# Altium project PCB_Project.PrjPcb
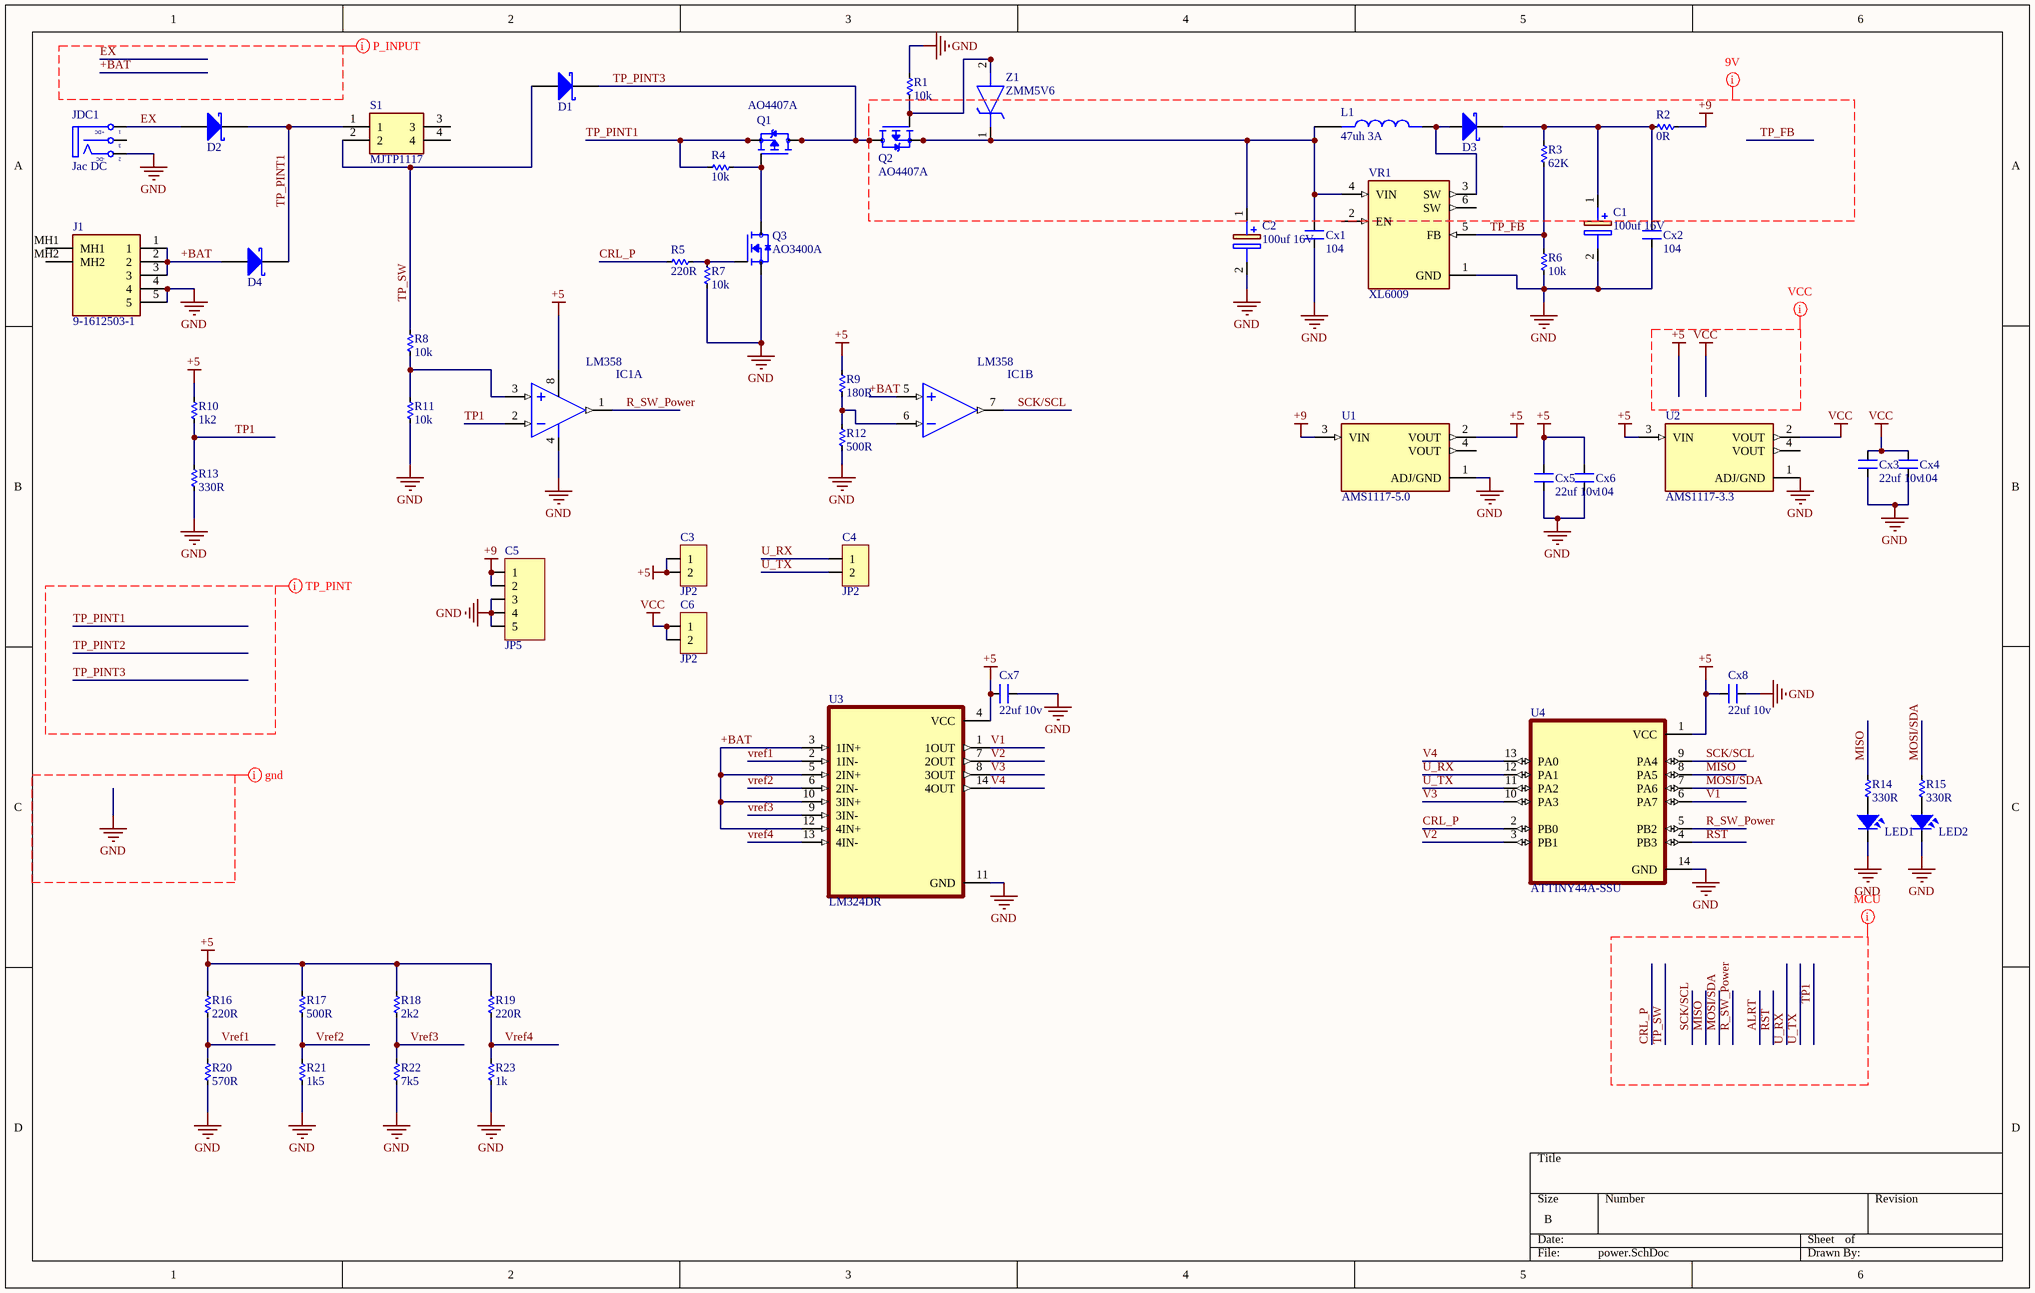
[diagram p0: power.SchDoc]
1 sheet, 57 parts. Net scope: global (net labels, ports and power ports of the same name join across sheets).
Board file: Power.PcbDoc

## Sheet power.SchDoc
size B

### Parts
C1  100uf 16V  [CAPPM7343X310N]
C2  100uf 16V  [CAPPM7343X310N]
C3  JP2  [JP2-C1T]
C4  JP2  [JP2-C1T]
C5  JP5  [JP5-C1T]
C6  JP2  [JP2-C1T]
Cx1  104  [CN-SMD-0805]
Cx2  104  [CN-SMD-0805]
Cx3  22uf 10v  [CN-SMD-1206]
Cx4  104  [CN-SMD-0805]
Cx5  22uf 10v  [CN-SMD-1206]
Cx6  104  [CN-SMD-0805]
Cx7  22uf 10v  [CN-SMD-1206]
Cx8  22uf 10v  [CN-SMD-1206]
D1  D Schottky  [SS34]  (value not drawn)
D2  D Schottky  [SS34]  (value not drawn)
D3  D Schottky  [SS34]  (value not drawn)
D4  D Schottky  [SS34]  (value not drawn)
IC1  LM358  [SO8]  (parts A,B of 2)
J1  9-1612503-1  [916125031]
JDC1  Jac DC  [DC3]
L1  47uh 3A  [IND_#B952AS-H-470M=P3]
LED1  LED  [LED-0805-Red]  (value not drawn)
LED2  LED  [LED-0805-Green]  (value not drawn)
Q1  AO4407A  [SOIC127P600X175-8N]
Q2  AO4407A  [SOIC127P600X175-8N]
Q3  AO3400A  [SOT95P280X125-3N]
R1  10k  [RES-SMD-0603]
R2  0R  [RES-SMD-0603]
R3  62K  [RES-SMD-0603]
R4  10k  [RES-SMD-0603]
R5  220R  [RES-SMD-0603]
R6  10k  [RES-SMD-0603]
R7  10k  [RES-SMD-0603]
R8  10k  [RES-SMD-0603]
R9  180R  [RES-SMD-0603]
R10  1k2  [RES-SMD-0603]
R11  10k  [RES-SMD-0603]
R12  500R  [RES-SMD-0603]
R13  330R  [RES-SMD-0603]
R14  330R  [RES-SMD-0603]
R15  330R  [RES-SMD-0603]
R16  220R  [RES-SMD-0603]
R17  500R  [RES-SMD-0603]
R18  2k2  [RES-SMD-0603]
R19  220R  [RES-SMD-0603]
R20  570R  [RES-SMD-0603]
R21  1k5  [RES-SMD-0603]
R22  7k5  [RES-SMD-0603]
R23  1k  [RES-SMD-0603]
S1  MJTP1117  [MJTP1117]
U1  AMS1117-5.0  [SOT229P700X180-4N]
U2  AMS1117-3.3  [SOT229P700X180-4N]
U3  LM324DR  [SOIC127P600X175-14N]
U4  ATTINY44A-SSU  [SOIC127P600X175-14N]
VR1  XL6009  [DPAK170P1435X465-6N]
Z1  ZMM5V6  [ZMM5V6]

### Nets
+5: C3.1 C3.2 Cx5.2 Cx6.2 Cx7.1 Cx8.2 IC1.8(+V) R9.1 R10.1 R16.1 R17.1 R18.1 R19.1 U1.2(VOUT) U2.3(VIN) U3.4(VCC) U4.1(VCC)
+9: C5.1 C5.2 R2.2 U1.3(VIN)
GND: C1.2(-) C2.2(-) C5.3 C5.4 C5.5 Cx1.1 Cx2.1 Cx3.1 Cx4.1 Cx5.1 Cx6.1 Cx7.2 Cx8.1 IC1.4(-V) J1.4 J1.5 JDC1.2(TN) LED1.2 LED2.2 Q3.2(S) R1.2 R6.2 R7.1 R11.2 R12.2 R13.2 R20.2 R21.2 R22.2 R23.2 U1.1(ADJ/GND) U2.1(ADJ/GND) U3.11(GND) U4.14(GND) VR1.1(GND)
VCC: C6.1 C6.2 Cx3.2 Cx4.2 U2.2(VOUT)
+BAT: D4.1(A) IC1.5(IN+) J1.1 J1.2 J1.3 U3.3(1IN+) U3.5(2IN+) U3.10(3IN+) U3.12(4IN+)
CRL_P: R5.1 U4.2(PB0)
EX: D2.1(A) JDC1.1(T)
MISO: R14.2 U4.8(PA5)
MOSI/SDA: R15.2 U4.7(PA6)
R_SW_Power: IC1.1(OUT) U4.5(PB2)
RST: U4.4(PB3)
SCK/SCL: IC1.7(OUT) U4.9(PA4)
TP1: IC1.2(IN-) R10.2 R13.1
TP_FB: R3.1 R6.1 VR1.5(FB)
TP_PINT1: D2.2(K) D4.2(K) Q1.1(S) Q1.2(S) Q1.3(S) R4.1 S1.1
TP_PINT3: D1.2(K) Q1.5(D) Q1.6(D) Q1.7(D) Q1.8(D) Q2.5(D) Q2.6(D) Q2.7(D) Q2.8(D)
TP_SW: D1.1(A) R8.1 S1.2
U_RX: C4.1 U4.12(PA1)
U_TX: C4.2 U4.11(PA2)
V1: U3.1(1OUT) U4.6(PA7)
V2: U3.7(2OUT) U4.3(PB1)
V3: U3.8(3OUT) U4.10(PA3)
V4: U3.14(4OUT) U4.13(PA0)
Vref1: R16.2 R20.1 U3.2(1IN-)
Vref2: R17.2 R21.1 U3.6(2IN-)
Vref3: R18.2 R22.1 U3.9(3IN-)
Vref4: R19.2 R23.1 U3.13(4IN-)
NetC1_1: C1.1(+) Cx2.2 D3.2(K) R2.1 R3.2
NetC2_1: C2.1(+) Cx1.2 L1.1 Q2.1(S) Q2.2(S) Q2.3(S) VR1.4(VIN) Z1.1(K)
NetD3_1: D3.1(A) L1.2 VR1.3(SW)
NetIC1_3: IC1.3(IN+) R8.2 R11.1
NetIC1_6: IC1.6(IN-) R9.2 R12.1
NetLED1_1: LED1.1 R14.1
NetLED2_1: LED2.1 R15.1
NetQ1_4: Q1.4(G) Q3.3(D) R4.2
NetQ2_4: Q2.4(G) R1.1 Z1.2(A)
NetQ3_1: Q3.1(G) R5.2 R7.2

Not connected (* = marked no-connect by the designer): J1 MH1 MH2; JDC1 3(S); S1 3 4; U1 4(VOUT); U2 4(VOUT); VR1 2(EN) 6(SW)

### Layout directives
net class MCU: ALRT, CRL_P, MISO, MOSI/SDA, R_SW_Power, RST, SCK/SCL, TP1, TP_SW, U_RX, U_TX
net class VCC: +5, VCC
net class 9V: +9, TP_FB
net class P_INPUT: +BAT, EX
net class TP_PINT: TP_PINT1, TP_PINT2, TP_PINT3
net class gnd: GND

### Notes on the sheet
- (in symbol DCIN) +DC; -DC

### Library data of the parts
C1 C2 = T495D107K010ATA100: Capacitor Polarised; Manufacturer_Name: Kemet; Datasheet Link: https://www.arrow.com/en/products/t495d107k010ata100/kemet-corporation; Height: 3.1mm; Manufacturer_Part_Number: T495D107K010ATA100; Arrow Part Number: T495D107K010ATA100; Arrow Price/Stock: https://www.arrow.com/en/products/t495d107k010ata100/kemet-corporation
C3 C4 C6 = JP2: WR-PHD 2.54 mm Angled Socket Header; Manufacturer: W¨¹rth Elektronik eiSos GmbH; partNo: 613002143121; ComponentLink1 Description: Manufacturer; ComponentLink2 Description: Datasheet; NoPins: 02; Created Date: 29 March 2013; ComponentLink1URL: http://www.we-online.com; ComponentLink2URL: http://katalog.we-online.de/em/datasheet/6130xx143121.pdf; Created by: Karrer Zheng
C5 = JP5: WR-PHD 2.54 mm Angled Socket Header; Manufacturer: W¨¹rth Elektronik eiSos GmbH; partNo: 613005143121; ComponentLink1 Description: Manufacturer; ComponentLink2 Description: Datasheet; NoPins: 05; Created Date: 29 March 2013; ComponentLink1URL: http://www.we-online.com; ComponentLink2URL: http://katalog.we-online.de/em/datasheet/6130xx143121.pdf; Created by: Karrer Zheng
Cx1-Cx8 = CN: Value: 33pF
D1-D4 = D Schottky: Schottky Diode; Published: 8-Jun-2000; LatestRevisionDate: 17-Jul-2002; LatestRevisionNote: Re-released for DXP Platform.; PackageReference: SMB; Publisher: Altium Limited; PackageDescription: DO-214-AA/SMB; 2 C-Bend Leads; Body 5.3 x 3.6 mm, inc. leads (LxW); Code_JEDEC: DO-214-AA
IC1 = LM358: Low-Power Dual Operational Amplifier; Value: LM358
J1 = 9-1612503-1: Connector; Manufacturer_Name: TE Connectivity; Datasheet Link: https://www.te.com/commerce/DocumentDelivery/DDEController?Action=showdoc&DocId=Customer+Drawing%7F1612503%7FE%7Fpdf%7FEnglish%7FENG_CD_1612503_E.pdf%7F9-1612503-1; Height: 4.8mm; Manufacturer_Part_Number: 9-1612503-1; Mouser Part Number: 571-9-1612503-1; Mouser Price/Stock: https://www.mouser.co.uk/ProductDetail/TE-Connectivity/9-1612503-1/?qs=7ao7SdBpJfrtkNNaVbJcWQ%3D%3D
JDC1 = DCIN: Jac DC input; Value: Jac DC
L1 = #B952AS-H-470M=P3: Wire Wound Ferrite Inductor for Power Lines; Package: None; Price: None; Value: *; MP: #B952AS-H-470M=P3; Availability: Unavailable
LED1 LED2 = LED SMD: Value: LED 3 - 5 ly 2 Colour
Q1 Q2 = AO4407A: P-Channel 30V 12A _Ta_ 3.1W _Ta_ Surface Mount 8-SOIC; MF: Alpha &; Value: *; SnapEDA_Link: https://www.snapeda.com/parts/AO4407A/Alpha%20%26%20Omega%20Semiconductor%20Inc./view-part/492696/?ref=snap; MP: AO4407A; Availability: Unavailable; Price: None; Package: SOIC-8 Alpha &amp; Omega Semiconductor
Q3 = AO3400A: N-Channel 30V 5.7A _Ta_ 1.4W _Ta_ Surface Mount SOT-23-3L; MF: Alpha &; Package: SOT-23 Alpha &amp; Omega Semiconductor; Value: *; Price: None; MP: AO3400A; Availability: Unavailable; SnapEDA_Link: https://www.snapeda.com/parts/AO3400A/Alpha%20%26%20Omega%20Semiconductor%20Inc./view-part/405248/?ref=snap
R1-R23 = Res-SMD: Resistor; Manufacturer: Generic Components; Class: Passive; Published: 08/06/2000; Publisher: Altium Hobart Technology Centre
S1 = MJTP1117: Switch; Manufacturer_Name: Apem; Datasheet Link: https://media.digikey.com/pdf/Data%20Sheets/APEM%20Components%20PDFs/MJTP%20Series-6MM.pdf; Height: 4.3mm; Manufacturer_Part_Number: MJTP1117; Mouser Part Number: 642-MJTP1117; Mouser Price/Stock: https://www.mouser.co.uk/ProductDetail/Apem/MJTP1117?qs=6hR9CYnVCPAeQNDPI%2FtCng%3D%3D
U1 U2 = AMS1117-5.0: Sot223/Pkg 1-Amp 5-Volt Low Drop Out Voltage Regulatator; MF: Advanced Monolithic Systems; Package: None; SnapEDA_Link: https://www.snapeda.com/parts/AMS1117-5.0/Advanced%20Monolithic%20Systems/view-part/184433/?ref=snap; Price: None; Availability: Unavailable; MP: AMS1117-5.0; Value: *
U3 = LM324DR: 4-Channel industry standard operational amplifier 14-SOIC 0 to 70; MF: Texas Instruments; SnapEDA_Link: https://www.snapeda.com/parts/LM324DR/Texas%20Instruments/view-part/1818/?ref=snap; Arrow_Electronics-Purchase-URL: https://snapeda.com/shop?store=Arrow+Electronics&id=1818; Value: *; MP: LM324DR; Availability: Good; Texas_Instruments-Purchase-URL: https://snapeda.com/shop?store=Texas+Instruments&id=1818; DigiKey-Purchase-URL: https://snapeda.com/shop?store=DigiKey&id=1818; Package: SOIC-14 Texas Instruments; Mouser-Purchase-URL: https://snapeda.com/shop?store=Mouser&id=1818; Price: None
U4 = ATTINY44A-SSU: AVR AVRÂ® ATtiny Microcontroller IC 8-Bit 20MHz 4KB (2K x 16) FLASH 14-SOIC; MF: Microchip; SnapEDA_Link: https://www.snapeda.com/parts/ATTINY44A-SSU/Microchip/view-part/666505/?ref=snap; Price: None; MP: ATTINY44A-SSU; Package: SOIC-14 Microchip; Value: *; Availability: Unavailable
VR1 = XL6009: The XL6009 regulator is a wide input range, current mode, DC/DC converter which is capable of generating either positive or negative output voltages.; MF: XLSEMI; MP: XL6009; Price: None; Availability: Unavailable; Package: Package Analog Devices; SnapEDA_Link: https://www.snapeda.com/parts/XL6009/XLSEMI/view-part/2888428/?ref=snap; Value: *
Z1 = ZMM5V6: Zener Diode; Manufacturer_Name: Lite-On; Datasheet Link: https://4donline.ihs.com/images/VipMasterIC/IC/LITE/LITES00631/LITES00631-1.pdf?hkey=EF798316E3902B6ED9A73243A3159BB0; Height: 1.6mm; Manufacturer_Part_Number: ZMM5V6